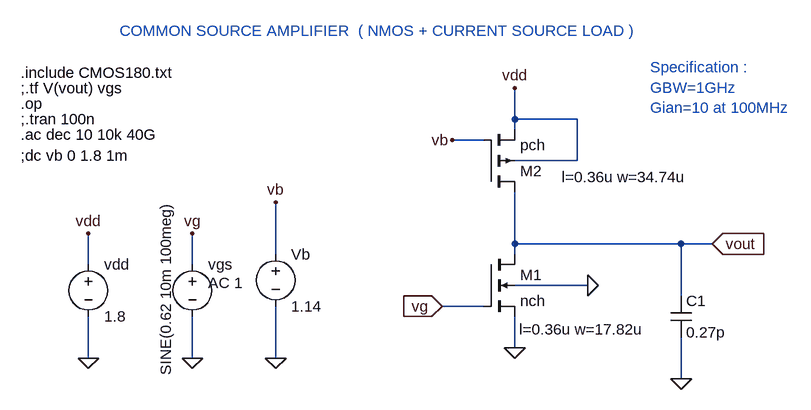
[diagram p0: schematic CS AMPLIFIER (NMOS + PMOS Current Source).asc]
CS AMPLIFIER (NMOS + PMOS Current Source).asc, the LTspice schematic file:
Version 4
SHEET 1 880 732
WIRE 368 64 368 16
WIRE 464 64 368 64
WIRE 368 80 368 64
WIRE 320 96 272 96
WIRE 464 128 464 64
WIRE 464 128 368 128
WIRE 368 256 368 176
WIRE 624 256 368 256
WIRE 672 256 624 256
WIRE 0 272 0 192
WIRE 368 272 368 256
WIRE -288 288 -288 240
WIRE -128 288 -128 240
WIRE 480 320 368 320
WIRE 624 336 624 256
WIRE 320 352 256 352
WIRE 368 416 368 368
WIRE -288 432 -288 368
WIRE -128 432 -128 368
WIRE 0 432 0 352
WIRE 624 464 624 400
FLAG -128 432 0
FLAG -288 432 0
FLAG -288 240 vdd
FLAG -128 240 vg
FLAG 256 352 vg
IOPIN 256 352 In
FLAG 672 256 vout
IOPIN 672 256 In
FLAG 624 464 0
FLAG 368 16 vdd
FLAG 0 432 0
FLAG 0 192 vb
FLAG 272 96 vb
FLAG 480 320 0
FLAG 368 416 0
SYMBOL nmos4 320 272 R0
WINDOW 123 55 116 Left 2
SYMATTR Value2 l=0.36u w=17.82u
SYMATTR InstName M1
SYMATTR Value nch
SYMBOL voltage -128 272 R0
WINDOW 3 -41 -81 VRight 2
WINDOW 123 24 44 Left 2
WINDOW 39 0 0 Left 0
SYMATTR Value SINE(0.62 10m 100meg)
SYMATTR Value2 AC 1
SYMATTR InstName vgs
SYMBOL voltage -288 272 R0
WINDOW 123 0 0 Left 0
WINDOW 39 0 0 Left 0
SYMATTR InstName vdd
SYMATTR Value 1.8
SYMBOL cap 608 336 R0
SYMATTR InstName C1
SYMATTR Value 0.27p
SYMBOL pmos4 320 176 M180
WINDOW 123 120 23 Left 2
SYMATTR Value2 l=0.36u w=34.74u
SYMATTR InstName M2
SYMATTR Value pch
SYMBOL voltage 0 256 R0
WINDOW 123 0 0 Left 0
WINDOW 39 0 0 Left 0
SYMATTR InstName Vb
SYMATTR Value 1.14
TEXT -392 -8 Left 2 !.include CMOS180.txt
TEXT -392 40 Left 2 !.op
TEXT -392 16 Left 2 !;.tf V(vout) vgs
TEXT -392 64 Left 2 !;.tran 100n
TEXT -240 -72 Left 2 ;COMMON SOURCE AMPLIFIER  ( NMOS + CURRENT SOURCE LOAD )
TEXT -392 88 Left 2 !.ac dec 10 10k 40G
TEXT -392 120 Left 2 !;dc vb 0 1.8 1m
TEXT 576 -16 Left 2 ;Specification :\nGBW=1GHz\nGian=10 at 100MHz

The netlist it stands for:
* CS AMPLIFIER (NMOS + PMOS Current Source).asc
M1 vout vg 0 0 nch l=0.36u w=17.82u
vgs vg 0 SINE(0.62 10m 100meg) AC 1
vdd vdd 0 1.8
C1 vout 0 0.27p
M2 vout vb vdd vdd pch l=0.36u w=34.74u
Vb vb 0 1.14
.model NMOS NMOS
.model PMOS PMOS
.lib standard.mos
.include CMOS180.txt
.op
;.tf V(vout) vgs
;.tran 100n
* COMMON SOURCE AMPLIFIER  ( NMOS + CURRENT SOURCE LOAD )
.ac dec 10 10k 40G
;dc vb 0 1.8 1m
* Specification :
* GBW=1GHz
* Gian=10 at 100MHz
.backanno
.end

* Results of the author's LTspice run, read from the files saved beside the schematic
* Operating Point, zero values left out:
*   V(vout) = 1.069 V
*   V(vg) = 620 mV
*   V(vdd) = 1.8 V
*   V(vb) = 1.14 V
*   Id(M2) = -162.5 µA
*   Is(M2) = 162.5 µA
*   Id(M1) = 162.5 µA
*   Ib(M1) = -1.079 pA
*   Is(M1) = -162.5 µA
*   I(Vdd) = -162.5 µA
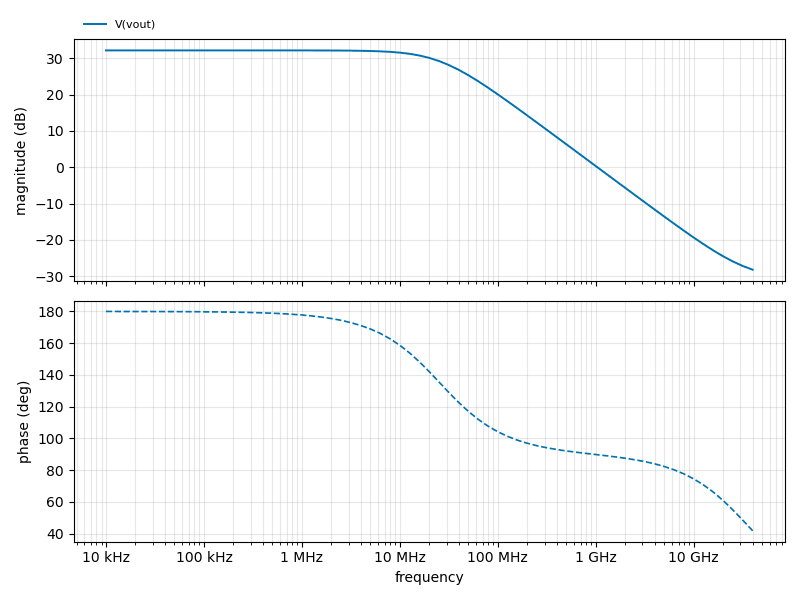
[diagram p1: AC Analysis of CS AMPLIFIER (NMOS + PMOS Current Source).asc, plotted from the saved traces]
* AC Analysis, 1 run:
*   V(vout): 32.17 dB at 10 kHz, -28.18 dB at 40 GHz, peak 32.17 dB at 10 kHz, 3 dB below the peak at 25.58 MHz